# EAGLE schematic LED_Resistors (EAGLE 8.6.1)
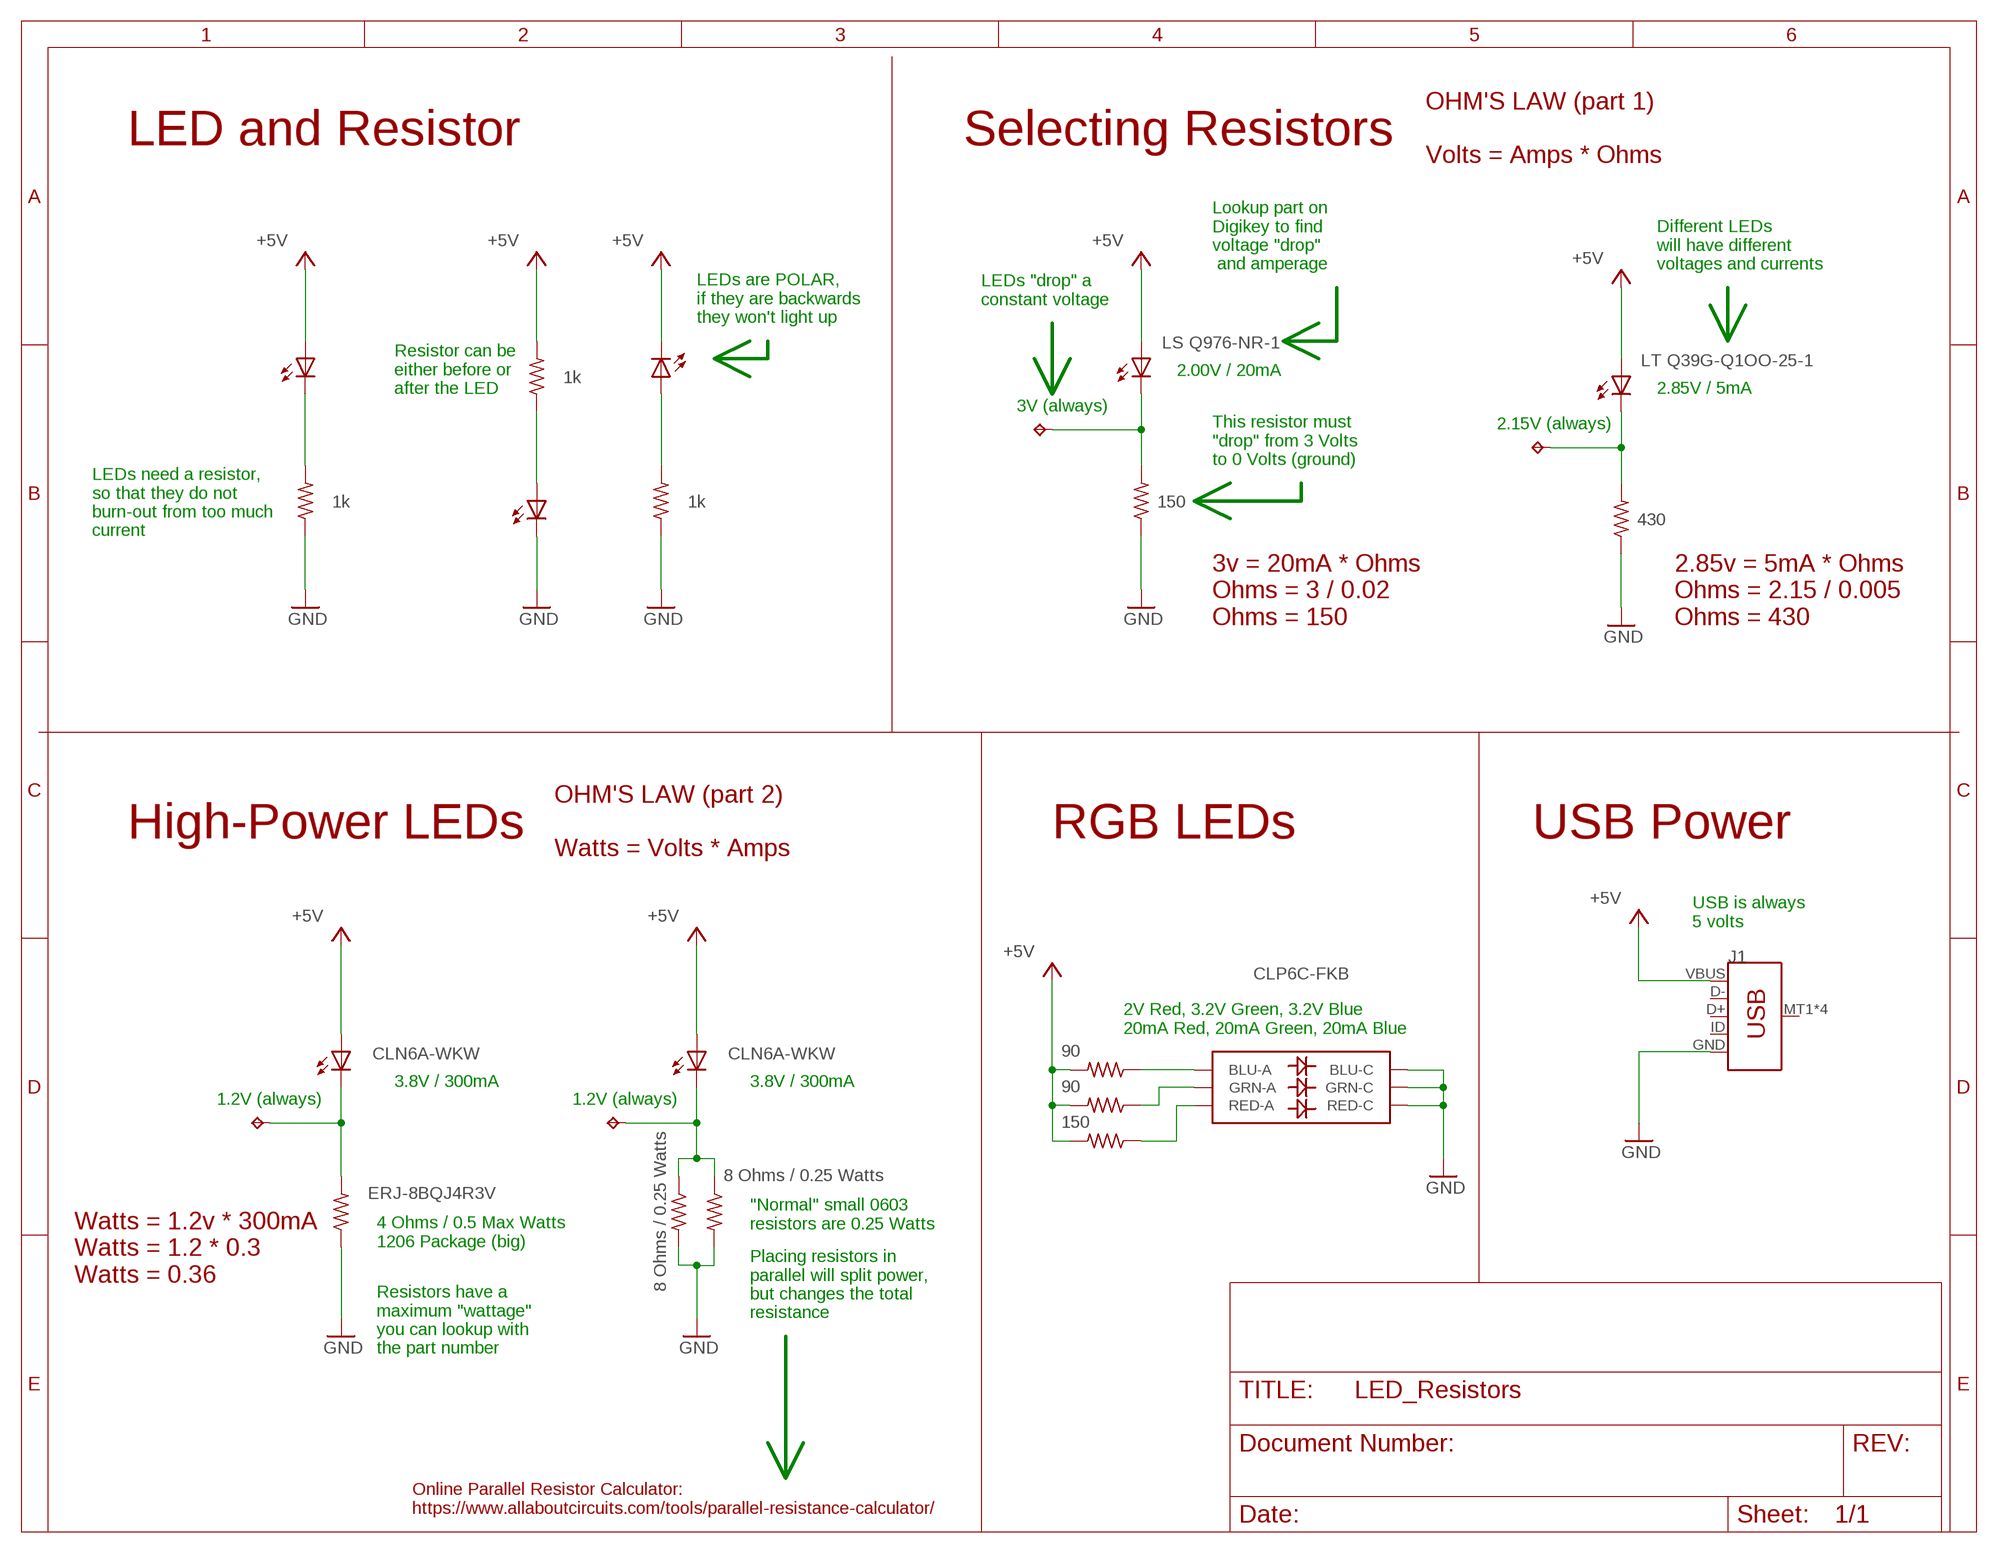
[diagram p0: schematic, sheet 1]

## Parts
D1  CLP6C-FKB  LED-RGBPLCC-6  [PLCC-6-LED]
J1  USB_MICRO-B_SMT  [USB-MICROB]
LED1  LEDCHIP-LED0603  [CHIP-LED0603]
LED2  LEDCHIP-LED0603  [CHIP-LED0603]
LED3  LEDCHIP-LED0603  [CHIP-LED0603]
LED4  LS Q976-NR-1  LEDCHIP-LED0603  [CHIP-LED0603]
LED5  LT Q39G-Q1OO-25-1  LEDCHIP-LED0603  [CHIP-LED0603]
LED6  CLN6A-WKW  [CLN6A]
LED7  CLN6A-WKW  [CLN6A]
R1  1k  R-US_R0603  [R0603]
R2  1k  R-US_R0603  [R0603]
R3  1k  R-US_R0603  [R0603]
R4  150  R-US_R0603  [R0603]
R5  430  R-US_R0603  [R0603]
R6  ERJ-8BQJ4R3V  R-US_R1206  [R1206]
R7  90  R-US_R0603  [R0603]
R8  90  R-US_R0603  [R0603]
R9  150  R-US_R0603  [R0603]
R10  8 Ohms / 0.25 Watts  R-US_R0603  [R0603]
R11  8 Ohms / 0.25 Watts  R-US_R0603  [R0603]
TP1  TPTP20R  [TP20R]
TP2  TPTP20R  [TP20R]
TP3  TPTP20R  [TP20R]
TP4  TPTP20R  [TP20R]

## Nets
+5V: J1.VBUS LED1.A LED3.C LED4.A LED5.A LED6.4(A) LED6.5(A) LED6.6(A) LED7.4(A) LED7.5(A) LED7.6(A) R1.2 R7.2 R8.2 R9.2
GND: D1.CB(BLU-C) D1.CG(GRN-C) D1.CR(RED-C) J1.GND LED2.C R2.1 R3.1 R4.1 R5.1 R6.1 R10.2 R11.2
N$1: LED1.C R2.2
N$2: LED2.A R1.1
N$3: LED3.A R3.2
N$4: LED4.C R4.2 TP1.TP
N$5: LED5.C R5.2 TP2.TP
N$6: LED6.1(C) LED6.2(C) LED6.3(C) R6.2 TP3.TP
N$7: LED7.1(C) LED7.2(C) LED7.3(C) R10.1 R11.1 TP4.TP
N$9: D1.AB(BLU-A) R7.1
N$10: D1.AG(GRN-A) R8.1
N$11: D1.AR(RED-A) R9.1
Unconnected: J1.D+ J1.D- J1.ID J1.MT1(SHIELD) J1.MT2(SHIELD) J1.P$1(SHIELD) J1.P$2(SHIELD) LED6.HT(TH) LED7.HT(TH)

## Notes on the sheet
- LED and Resistor | Selecting Resistors
- OHM'S LAW (part 1)
  
  Volts = Amps * Ohms
- Lookup part on
  Digikey to find
  voltage "drop"
   and amperage
- Different LEDs
  will have different
  voltages and currents
- LEDs "drop" a
  constant voltage
- LEDs are POLAR,
  if they are backwards
  they won't light up
- 2.00V / 20mA
- Resistor can be
  either before or
  after the LED
- 2.85V / 5mA
- 3V (always)
- 2.15V (always)
- This resistor must
  "drop" from 3 Volts
  to 0 Volts (ground)
- LEDs need a resistor,
  so that they do not
  burn-out from too much
  current
- 3v = 20mA * Ohms
  Ohms = 3 / 0.02
  Ohms = 150
- 2.85v = 5mA * Ohms
  Ohms = 2.15 / 0.005
  Ohms = 430
- High-Power LEDs | RGB LEDs | USB Power
- OHM'S LAW (part 2)
  
  Watts = Volts * Amps
- USB is always
  5 volts
- 2V Red, 3.2V Green, 3.2V Blue
  20mA Red, 20mA Green, 20mA Blue
- 3.8V / 300mA | 3.8V / 300mA
- 1.2V (always) | 1.2V (always)
- "Normal" small 0603
  resistors are 0.25 Watts
- 4 Ohms / 0.5 Max Watts
  1206 Package (big)
- Watts = 1.2v * 300mA
  Watts = 1.2 * 0.3
  Watts = 0.36
- Placing resistors in
  parallel will split power,
  but changes the total
  resistance
- Resistors have a
  maximum "wattage"
  you can lookup with
  the part number
- Online Parallel Resistor Calculator:
  https://www.allaboutcircuits.com/tools/parallel-resistance-calculator/

## Library data of the parts
D1 = SparkFun-LED:LED-RGB: LED-RGB 6 pin RGB LED (no common connector) Packages: PLCC-6 LED-TRICOLOR-5050 - No built-in IC SparkFun Products: Digital Sandbox <https://www.sparkfun.com/products/12651> LED- SMD RGB <https://www.sparkfun.com/products/10866>; PROD_ID: DIO-12113; VALUE: RGB
J1 = SparkFun-Connectors:USB_MICRO-B: USB Type Micro-B Connector Male/female and PTH/SMT variants SparkFun Products: SparkFun microB USB Breakout <https://www.sparkfun.com/products/12035> SparkFun USB microB Plug Breakout <https://www.sparkfun.com/products/10031> SparkFun ESP8266 Thing <https://www.sparkfun.com/products/13231>; PROD_ID: CONN-09505; SF_ID: PRT-08533
LED1-LED5 = adafruit:LED: LED OSRAM: - CHIPLED LG R971, LG N971, LY N971, LG Q971, LY Q971, LO R971, LY R971 LH N974, LH R974 LS Q976, LO Q976, LY Q976 LO Q996 - Hyper CHIPLED LW Q18S LB Q993, LB Q99A, LB R99A - SideLED LS A670, LO A670, LY A670, LG A670, LP A670 LB A673, LV A673, LT A673, LW A673 LH A674 LY A675 LS A676, LA A676, LO A676, LY A676, LW A676 LS A679, LY A679, LG A679 - Hyper Micro SIDELED® LS Y876, LA Y876, LO Y876, LY Y876 LT Y87S - SmartLED LW L88C, LW L88S LB L89C, LB L89S, LG L890 LS L89K, LO L89K, LY L89K LS L896, LA L896, LO L896, LY L896 - TOPLED LS T670, LO T670, LY T670, LG T670, LP T670 LSG T670, LSP T670, LSY T670, LOP T670, LYG T670 LG T671, LOG T671, LSG T671 LB T673, LV T673, LT T673, LW T673 LH T674 LS T676, LA T676, LO T676, LY T676, LB T676, LH T676, LSB T676, LW T676 LB T67C, LV T67C, LT T67C, LS T67K, LO T67K, LY T67K, LW E67C LS E67B, LA E67B, LO E67B, LY E67B, LB E67C, LV E67C, LT E67C LW T67C LS T679, LY T679, LG T679 LS T770, LO T770, LY T770, LG T770, LP T770 LB T773, LV T773, LT T773, LW T773 LH T774 LS E675, LA E675, LY E675, LS T675 LS T776, LA T776, LO T776, LY T776, LB T776 LHGB T686 LT T68C, LB T68C - Hyper Mini TOPLED® LB M676 - Mini TOPLED Santana® LG M470 LS M47K, LO M47K, LY M47K Source: http://www.osram.convergy.de/
LED6 LED7 = led:CLN6A: Cree® CLN6A-WKW/MKW LED Source: Data sheet <http://www.cree.com/products/pdf/LEDlamps/CLN6A%28979%29.pdf>
R1-R11 = adafruit:R-US_: RESISTOR, American symbol
TP1-TP4 = testpad:TP: Test pad